# EAGLE design control_board (EAGLE 9.3.2)
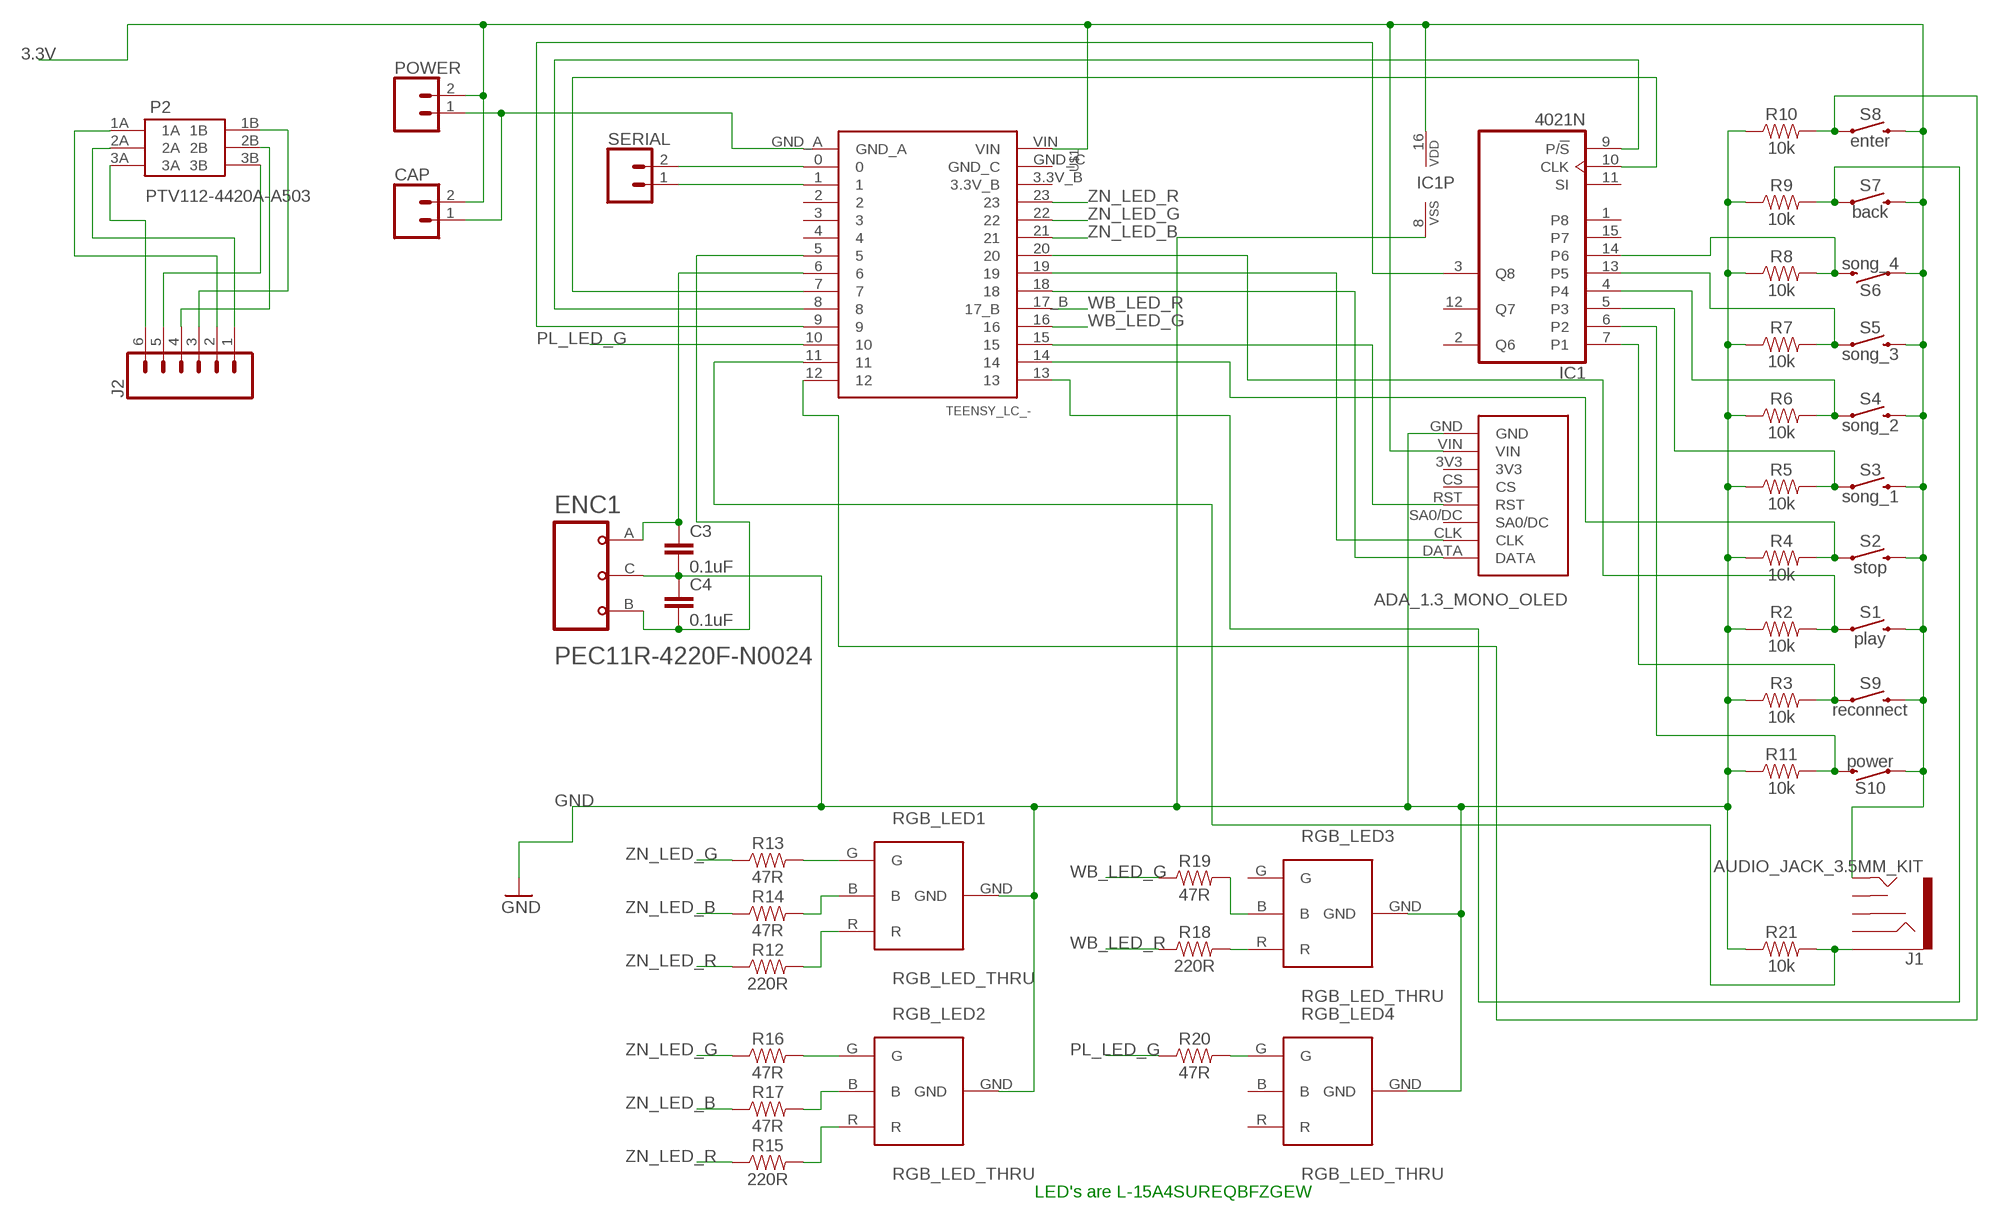
[diagram p0: schematic, sheet 1]

## Parts
C3  0.1uF  0.1UF-KIT-EZ-50V-20%  [CAP-PTH-SMALL-KIT]
C4  0.1uF  0.1UF-KIT-EZ-50V-20%  [CAP-PTH-SMALL-KIT]
CAP  CONN_02  [1X02]
ENC1  PEC11R-4220F-N0024  [PEC11R-4220F-N0024]
IC1  4021N  [DIL16]
J1  AUDIO_JACK_3.5MM_KIT  [AUDIO-JACK-KIT]
J2  CONN_06NO_SILK_NO_POP  [1X06_NO_SILK]
OLED1  ADA_1.3_MONO_OLED  [ADA_1.3_MONO_OLED]
P2  PTV112-4420A-A503  [PTV122-4420A-A503]
POWER  CONN_02  [1X02]
R2  10k  10KOHM-HORIZ-1/4W-1%  [AXIAL-0.3]
R3  10k  10KOHM-HORIZ-1/4W-1%  [AXIAL-0.3]
R4  10k  10KOHM-HORIZ-1/4W-1%  [AXIAL-0.3]
R5  10k  10KOHM-HORIZ-1/4W-1%  [AXIAL-0.3]
R6  10k  10KOHM-HORIZ-1/4W-1%  [AXIAL-0.3]
R7  10k  10KOHM-HORIZ-1/4W-1%  [AXIAL-0.3]
R8  10k  10KOHM-HORIZ-1/4W-1%  [AXIAL-0.3]
R9  10k  10KOHM-HORIZ-1/4W-1%  [AXIAL-0.3]
R10  10k  10KOHM-HORIZ-1/4W-1%  [AXIAL-0.3]
R11  10k  10KOHM-HORIZ-1/4W-1%  [AXIAL-0.3]
R12  220R  100OHM-HORIZ-1/4W-1%  [AXIAL-0.3]
R13  47R  100OHM-HORIZ-1/4W-1%  [AXIAL-0.3]
R14  47R  100OHM-HORIZ-1/4W-1%  [AXIAL-0.3]
R15  220R  100OHM-HORIZ-1/4W-1%  [AXIAL-0.3]
R16  47R  100OHM-HORIZ-1/4W-1%  [AXIAL-0.3]
R17  47R  100OHM-HORIZ-1/4W-1%  [AXIAL-0.3]
R18  220R  100OHM-HORIZ-1/4W-1%  [AXIAL-0.3]
R19  47R  100OHM-HORIZ-1/4W-1%  [AXIAL-0.3]
R20  47R  100OHM-HORIZ-1/4W-1%  [AXIAL-0.3]
R21  10k  10KOHM-HORIZ-1/4W-1%  [AXIAL-0.3]
RGB_LED1  RGB_LED_THRU  [RGB_LEB_RGB_2]
RGB_LED2  RGB_LED_THRU  [RGB_LEB_RGB_2]
RGB_LED3  RGB_LED_THRU  [RGB_LEB_RGB_2]
RGB_LED4  RGB_LED_THRU  [RGB_LEB_RGB_2]
S1  play  MOMENTARY-SWITCH-SPST-PTH-6.0MM  [TACTILE_SWITCH_PTH_6.0MM]
S2  stop  MOMENTARY-SWITCH-SPST-PTH-6.0MM  [TACTILE_SWITCH_PTH_6.0MM]
S3  song_1  MOMENTARY-SWITCH-SPST-PTH-6.0MM  [TACTILE_SWITCH_PTH_6.0MM]
S4  song_2  MOMENTARY-SWITCH-SPST-PTH-6.0MM  [TACTILE_SWITCH_PTH_6.0MM]
S5  song_3  MOMENTARY-SWITCH-SPST-PTH-6.0MM  [TACTILE_SWITCH_PTH_6.0MM]
S6  song_4  MOMENTARY-SWITCH-SPST-PTH-6.0MM  [TACTILE_SWITCH_PTH_6.0MM]
S7  back  MOMENTARY-SWITCH-SPST-PTH-6.0MM  [TACTILE_SWITCH_PTH_6.0MM]
S8  enter  MOMENTARY-SWITCH-SPST-PTH-6.0MM  [TACTILE_SWITCH_PTH_6.0MM]
S9  reconnect  MOMENTARY-SWITCH-SPST-PTH-6.0MM  [TACTILE_SWITCH_PTH_6.0MM]
S10  power  MOMENTARY-SWITCH-SPST-PTH-6.0MM  [TACTILE_SWITCH_PTH_6.0MM]
SERIAL  CONN_02  [1X02]
U$1  TEENSY_LC_-  [TEENSY_LC_-]

## Nets
3.3V: CAP.2 IC1.16(VDD) J1.TIP OLED1.VIN POWER.2 S1.3 S2.3 S3.3 S4.3 S5.3 S6.1 S7.3 S8.3 S9.3 S10.1 U$1.VIN
GND: C3.2 C4.1 CAP.1 ENC1.C(COMMON) IC1.8(VSS) OLED1.GND POWER.1 R2.P$1 R3.P$1 R4.P$1 R5.P$1 R6.P$1 R7.P$1 R8.P$1 R9.P$1 R10.P$1 R11.P$1 R21.P$1 RGB_LED1.GND RGB_LED2.GND RGB_LED3.GND RGB_LED4.GND U$1.GND_A
N$1: IC1.3(Q8) U$1.9
N$2: R13.P$2 RGB_LED1.G
N$3: R14.P$2 RGB_LED1.B
N$4: IC1.10(CLK) U$1.7
N$5: R12.P$2 RGB_LED1.R
N$6: R16.P$2 RGB_LED2.G
N$7: R17.P$2 RGB_LED2.B
N$8: IC1.9(P/!S) U$1.8
N$9: OLED1.DATA U$1.18
N$10: R4.P$2 S2.1 U$1.14
N$11: R9.P$2 S7.1 U$1.13
N$12: IC1.5(P3) R5.P$2 S3.1
N$13: IC1.4 R6.P$2 S4.1
N$14: J1.SLEEVE R21.P$2 U$1.11
N$15: IC1.13(P5) R7.P$2 S5.1
N$16: IC1.14(P6) R8.P$2 S6.3
N$17: SERIAL.1 U$1.1
N$18: R10.P$2 S8.1 U$1.12
N$19: C3.1 ENC1.A(CHANNEL_A) U$1.6
N$20: C4.2 ENC1.B(COMMON_B) U$1.5
N$21: IC1.7(P1) R3.P$2 S9.1
N$22: IC1.6(P2) R11.P$2 S10.3
N$23: R15.P$2 RGB_LED2.R
N$24: R19.P$2 RGB_LED3.B
N$25: R18.P$2 RGB_LED3.R
N$26: R20.P$2 RGB_LED4.G
N$27: R2.P$2 S1.1 U$1.20
N$28: SERIAL.2 U$1.0
N$29: J2.2 P2.1A
N$30: OLED1.CLK U$1.19
N$31: OLED1.RST U$1.15
N$32: J2.1 P2.2A
N$33: J2.6 P2.3A
N$34: J2.4 P2.2B
N$35: J2.5 P2.3B
N$38: J2.3 P2.1B
PL_LED_G: R20.P$1 U$1.10
WB_LED_G: R19.P$1 U$1.16
WB_LED_R: R18.P$1 U$1.17_B
ZN_LED_B: R14.P$1 R17.P$1 U$1.21
ZN_LED_G: R13.P$1 R16.P$1 U$1.22
ZN_LED_R: R12.P$1 R15.P$1 U$1.23
Unconnected: IC1.1(P8) IC1.2(Q6) IC1.11(SI) IC1.12(Q7) IC1.15(P7) J1.RING J1.RSH J1.TSH OLED1.3V3 OLED1.CS OLED1.SA0/DC RGB_LED3.G RGB_LED4.B RGB_LED4.R U$1.2 U$1.3 U$1.3.3V_B U$1.4 U$1.GND_C

## Notes on the sheet
- LED's are L-15A4SUREQBFZGEW

## Library data of the parts
C3 C4 = SparkFun-Capacitors:0.1UF: 0.1µF ceramic capacitors A capacitor is a passive two-terminal electrical component used to store electrical energy temporarily in an electric field.; PROD_ID: CAP-08370
CAP POWER SERIAL = SparkFun-Connectors:CONN_02: Multi connection point. Often used as Generic Header-pin footprint for 0.1 inch spaced/style header connections On any of the 0.1 inch spaced packages, you can populate with these: Break Away Headers - Straight <https://www.sparkfun.com/products/116> (PRT-00116) Break Away Male Headers - Right Angle <https://www.sparkfun.com/products/553> (PRT-00553) Female Headers <https://www.sparkfun.com/products/115> (PRT-00115) Break Away Headers - Machine Pin <https://www.sparkfun.com/products/117> (PRT-00117) Break Away Female Headers - Swiss Machine Pin <https://www.sparkfun.com/products/743> (PRT-00743) For SCREWTERMINALS and SPRING TERMINALS visit here: Screw Terimnals on SparkFun.com <https://www.sparkfun.com/search/results?term=Screw+Terminals> (5mm/3.5mm/2.54mm spacing) This device is also useful as a general connection point to wire up your design to another part of your project. Our various solder wires solder well into these plated through hole pads. Hook-Up Wire - Assortment (Stranded, 22 AWG) <https://www.sparkfun.com/products/11375> (PRT-11375) Hook-Up Wire - Assortment (Solid Core, 22 AWG) <https://www.sparkfun.com/products/11367> (PRT-11367) View the entire wire category on our website here <https://www.sparkfun.com/categories/141> Special notes: Molex polarized connector foot print use with: PRT-08233 with associated crimp pins and housings. 2.54_SCREWTERM for use with PRT-10571. 3.5mm Screw Terminal footprints for PRT-08084 5mm Screw Terminal footprints for use with PRT-08432
ENC1 = my_library:PEC11R-4220F-N0024
IC1 = 40xx:4021: 8-bit static SHIFT REGISTER
J1 = SparkFun-Connectors:AUDIO_JACK_3.5MM: Audio Jack 3.5mm variants of PTH and SMT stereo audio jack with bypass switches. SparkFun Products: SparkFun SparkPunk Sound Kit <[https://www.sparkfun.com/products/11177]> - PTH MP3 Trigger <https://www.sparkfun.com/products/13720> -3.5mm SMD SparkFun PicoBoard <https://www.sparkfun.com/products/11888>- 2.5mm SMD; PROD_ID: CONN-08774; SF_ID: PRT-08032
J2 = SparkFun-Connectors:CONN_06: Multi connection point. Often used as Generic Header-pin footprint for 0.1 inch spaced/style header connections On any of the 0.1 inch spaced packages, you can populate with these: Break Away Headers - Straight <https://www.sparkfun.com/products/116> (PRT-00116) Break Away Male Headers - Right Angle <https://www.sparkfun.com/products/553> (PRT-00553) Female Headers <https://www.sparkfun.com/products/115> (PRT-00115) Break Away Headers - Machine Pin <https://www.sparkfun.com/products/117> (PRT-00117) Break Away Female Headers - Swiss Machine Pin <https://www.sparkfun.com/products/743> (PRT-00743) Arduino Stackable Header - 6 Pin <https://www.sparkfun.com/products/9280> (PRT-09280) For SCREWTERMINALS and SPRING TERMINALS visit here: Screw Terimnals on SparkFun.com <https://www.sparkfun.com/search/results?term=Screw+Terminals> (5mm/3.5mm/2.54mm spacing) This device is also useful as a general connection point to wire up your design to another part of your project. Our various solder wires solder well into these plated through hole pads. Hook-Up Wire - Assortment (Stranded, 22 AWG) <https://www.sparkfun.com/products/11375> (PRT-11375) Hook-Up Wire - Assortment (Solid Core, 22 AWG) <https://www.sparkfun.com/products/11367> (PRT-11367) View the entire wire category on our website here <https://www.sparkfun.com/categories/141>
OLED1 = my_library:ADA_1.3_MONO_OLED
P2 = my_library:PTV112-4420A-A503
R2-R11 R21 = SparkFun-Resistors:10KOHM: 10kΩ resistor A resistor is a passive two-terminal electrical component that implements electrical resistance as a circuit element. Resistors act to reduce current flow, and, at the same time, act to lower voltage levels within circuits. - Wikipedia; PROD_ID: RES-12183
R12-R20 = SparkFun-Resistors:100OHM: 100Ω resistor A resistor is a passive two-terminal electrical component that implements electrical resistance as a circuit element. Resistors act to reduce current flow, and, at the same time, act to lower voltage levels within circuits. - Wikipedia; PROD_ID: RES-12181; VALUE: 100
RGB_LED1-RGB_LED4 = my_library:RGB_LED_THRU
S1-S10 = SparkFun-Switches:MOMENTARY-SWITCH-SPST: Momentary Switch (Pushbutton) - SPST Normally-open (NO) SPST momentary switches (buttons, pushbuttons). Variants PTH-12MM - 12mm square, through-hole Momentary Pushbutton Switch - 12mm Square <https://www.sparkfun.com/products/9190> (COM-09190) PTH-6.0MM, PTH-6.0MM-KIT - 6.0mm square, through-hole Mini Pushbutton Switch <https://www.sparkfun.com/products/97> (COM-00097) KIT package intended for soldering kit's - only one side of pads' copper is exposed. PTH-RIGHT-ANGLE-KIT - Right-angle, through-hole Right Angle Tactile Button <https://www.sparkfun.com/products/10791> - Used on SparkFun BigTime Watch Kit <https://www.sparkfun.com/products/11734> SMD-12MM - 12mm square, surface-mount Tactile Button - SMD (12mm) <https://www.sparkfun.com/products/12993> (COM-12993) Used on SparkFun PicoBoard <https://www.sparkfun.com/products/11888> SMD-4.5MM - 4.5mm Square Trackball Switch Used on SparkFun Blackberry Trackballer Breakout <https://www.sparkfun.com/products/13169> SMD-4.6MMX2.8MM - 4.60mm x 2.80mm, surface mount Used on SparkFun SAMD21 Mini Breakout <https://www.sparkfun.com/products/13664> SMD-5.2MM, SMD-5.2-REDUNDANT - 5.2mm square, surface-mount Mini Pushbutton Switch - SMD <https://www.sparkfun.com/products/8720> (COM-08720) Used on Arduino Pro Mini <https://www.sparkfun.com/products/11114> REDUNDANT package connects both switch circuits together SMD-6.0X3.5MM - 6.0 x 3.5mm, surface mount Momentary Reset Switch SMD <https://www.sparkfun.com/products/8229> (COM-08229) SMD-6.2MM-TALL - 6.2mm square, surface mount Tactile Button - SMD (6mm) <https://www.sparkfun.com/products/12992> Used on SparkFun Digital Sandbox <https://www.sparkfun.com/products/12651> SMD-RIGHT-ANGLE - Right-angle, surface mount Used on SparkFun Block for Intel® Edison - Arduino <https://www.sparkfun.com/products/13036>; PROD_ID: SWCH-08441; SF_SKU: COM-00097
U$1 = my_library:TEENSY_LC_-

## Board
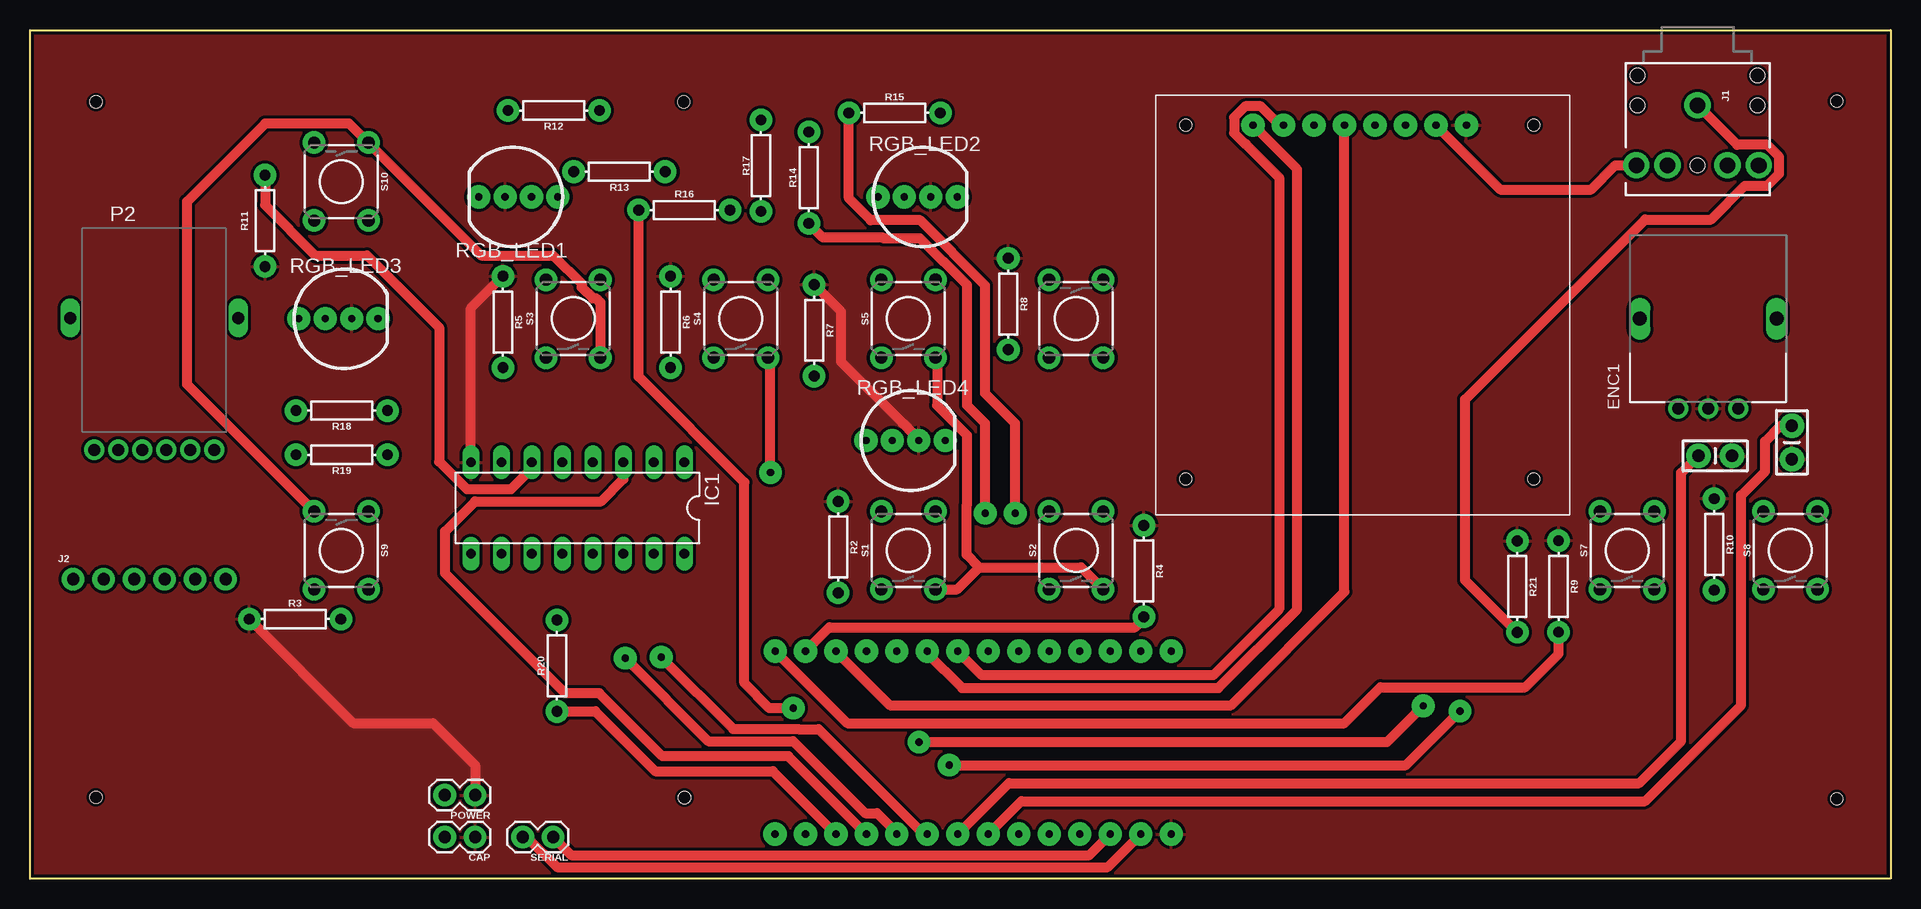
[diagram p1: board, top side]
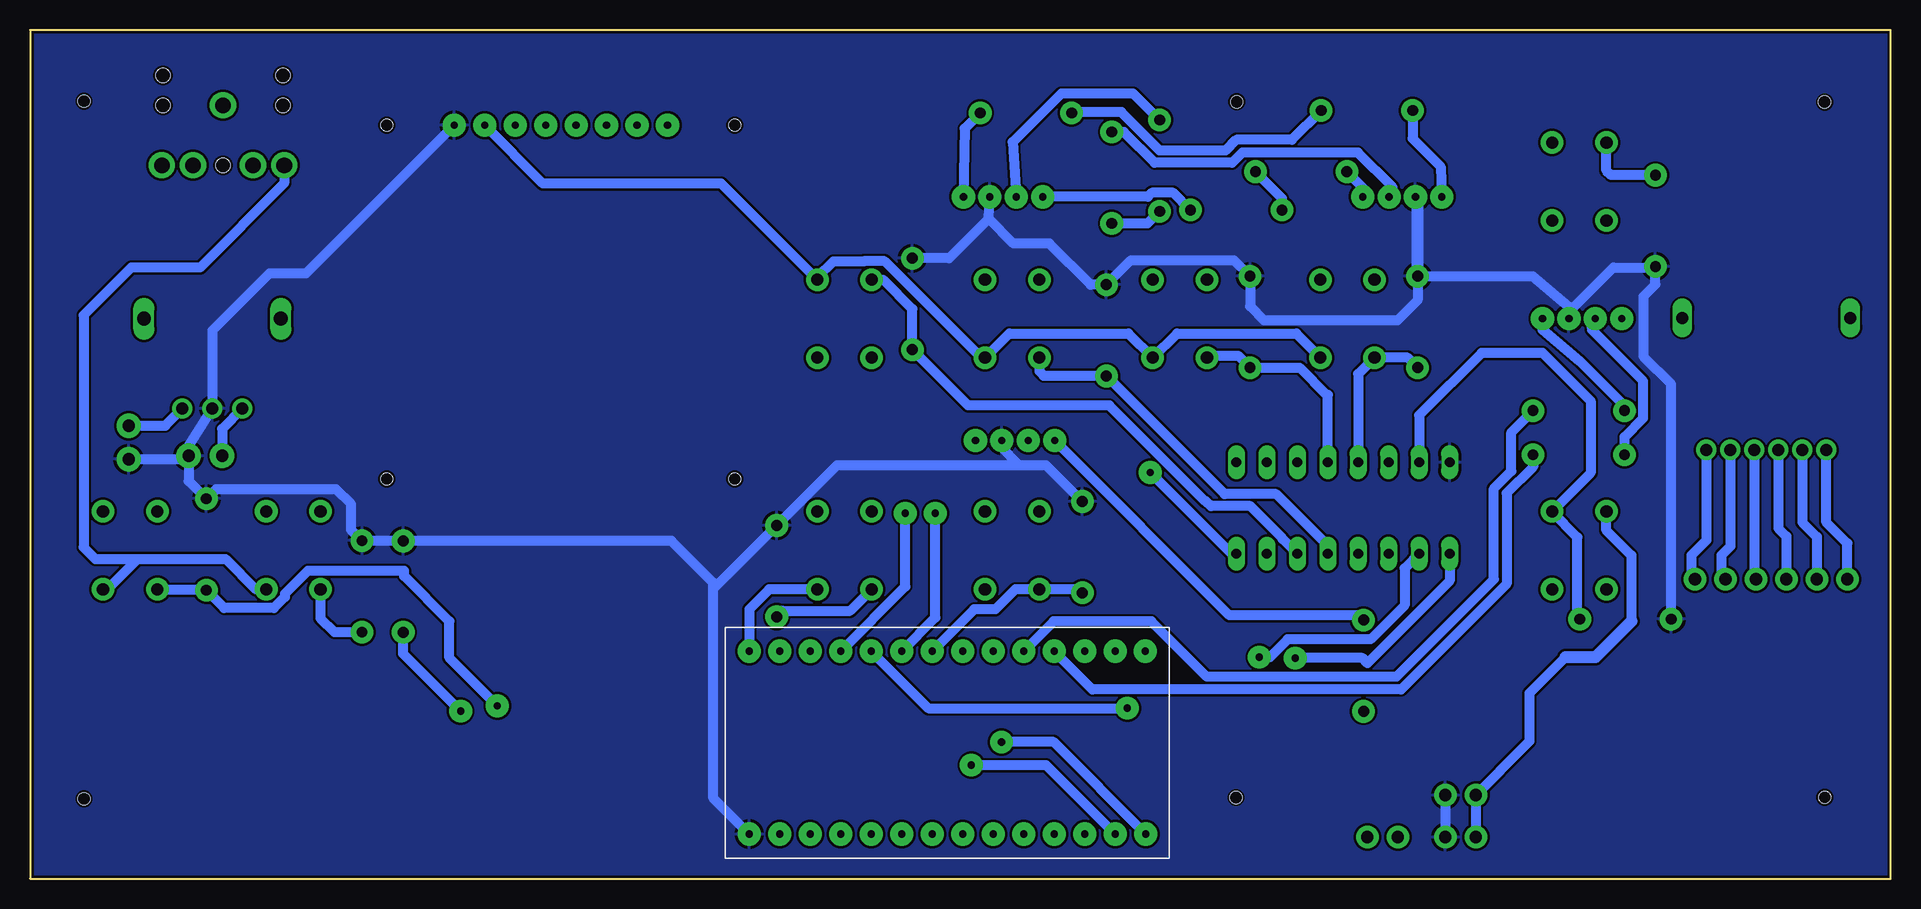
[diagram p2: board, bottom side, seen from below]

Size 155.05 x 70.77 mm. Coordinates in mm from the lower left corner, seen from the top.
Outline: 0,0 0,70.76 155.05,70.77 155.05,0 0,0
Copper layers (1*16): Top 0.035mm / dielectric 1.5mm / Bottom 0.035mm
Design rules "SparkFun": minimum track width 8mil, minimum drill 20mil, track to track 8mil, track to pad 8mil, pad to pad 8mil, via to via 8mil, smd to smd 8mil, copper to edge 8mil, drill to drill 8mil, minimum pad ring 12mil, minimum via ring 10mil, stop-mask expansion 4mil, vias tented up to drill 20mil, thermal gap 10mil
Holes 1 mm at 5.5,64.77 5.5,6.79 150.55,6.67 150.55,64.83 54.49,64.78 54.54,6.78

### Footprints (pad centres in the part's own frame; a part is rotated, then mirrored left to right if it is on the bottom)
CAP-PTH-SMALL-KIT = drill 1.016 pad 2.032: 1 -1.397,0; 2 1.397,0
1X02 = drill 1.016 pad 1.88: 1 0,0; 2 2.54,0
PEC11R-4220F-N0024 = drill 1.15 pad 1.75 long: 3 -5.7,0; 4 5.7,0 | drill 1 pad 1.676: A -2.5,-7.5; B 2.5,-7.5; C 0,-7.5
DIL16 = drill 0.813 long: 1 -8.89,-3.81; 2 -6.35,-3.81; 3 -3.81,-3.81; 4 -1.27,-3.81; 5 1.27,-3.81; 6 3.81,-3.81; 7 6.35,-3.81; 8 8.89,-3.81; 9 8.89,3.81; 10 6.35,3.81; 11 3.81,3.81; 12 1.27,3.81; 13 -1.27,3.81; 14 -3.81,3.81; 15 -6.35,3.81; 16 -8.89,3.81
AUDIO-JACK-KIT = drill 1.3 pad 2.184: RING 5,5.1; RSH 5,2.5; SLEEVE 0,0; TIP 5,-5.1; TSH 5,-2.5 | hole 1.2: 0,5; -2.5,5; -2.5,-5; 0,-5; 5,0
1X06_NO_SILK = drill 1.016 pad 1.88: 1 0,0; 2 2.54,0; 3 5.08,0; 4 7.62,0; 5 10.16,0; 6 12.7,0
ADA_1.3_MONO_OLED = drill 0.6 pad 1.93: 3V3 3.8,0; CLK -6.36,0; CS 1.26,0; DATA -8.9,0; GND 8.88,0; RST -1.28,0; SA0/DC -3.82,0; VIN 6.34,0 | hole 1: -14.5,0; 14.5,0; -14.5,-29.5; 14.5,-29.5
PTV122-4420A-A503 = drill 1 pad 1.676: 1A 2,0; 1B 4,0; 2A 0,0; 2B 6,0; 3A 10,0; 3B 8,0 | drill 1 long: L1 -2,11; L2 12,11
AXIAL-0.3 = drill 0.9 pad 1.88: P$1 -3.81,0; P$2 3.81,0
RGB_LEB_RGB_2 = drill 0.6 pad 1.93: B 2.2,0; G 0,0; GND 4.4,0; R 6.6,0
TACTILE_SWITCH_PTH_6.0MM = drill 1.016 pad 1.88: 1 -3.251,2.261; 2 3.251,2.261; 3 -3.251,-2.261; 4 3.251,-2.261
TEENSY_LC_- = drill 0.6 pad 1.93: 0 4.54,-17.25; 1 7.08,-17.25; 2 9.62,-17.25; 3 12.16,-17.25; 3.3V_B 7.08,-2; 4 14.7,-17.25; 5 17.24,-17.25; 6 19.78,-17.25; 7 22.32,-17.25; 8 24.86,-17.25; 9 27.4,-17.25; 10 29.94,-17.25; 11 32.48,-17.25; 12 35.02,-17.25; 13 35,-2; 14 32.48,-2; 15 29.94,-2; 16 27.4,-2; 17_B 24.86,-2; 18 22.32,-2; 19 19.78,-2; 20 17.24,-2; 21 14.7,-2; 22 12.16,-2; 23 9.62,-2; GND_A 2,-17.25; GND_C 4.54,-2; VIN 2,-2

### Placement (x,y rotation side)
C3  140.43,35.27 0 top
C4  146.82,36.38 90 top
CAP  37.1,3.48 180 top
ENC1  139.85,46.7 0 top
IC1  45.63,30.92 180 top
J1  138.96,64.49 270 top
J2  3.6,24.98 0 top
OLED1  110.82,62.84 0 top
P2  5.35,35.77 0 top
POWER  37.1,6.98 180 top
R2  67.35,27.65 270 top
R3  22.09,21.65 0 top
R4  92.82,25.65 270 top
R5  39.41,46.43 270 top
R6  53.38,46.43 270 top
R7  65.35,45.73 270 top
R8  81.52,47.93 270 top
R9  127.38,24.38 270 top
R10  140.35,27.88 270 top
R11  19.59,54.86 90 top
R12  43.64,64.06 180 top
R13  49.12,58.96 180 top
R14  64.9,58.46 90 top
R15  72.05,63.86 0 top
R16  54.53,55.76 0 top
R17  60.91,59.46 90 top
R18  25.98,39.04 180 top
R19  25.98,35.35 180 top
R20  43.91,17.77 90 top
R21  123.95,24.36 270 top
RGB_LED1  43.99,56.86 180 top
RGB_LED2  70.66,56.86 0 top
RGB_LED3  22.4,46.7 0 top
RGB_LED4  69.66,36.54 0 top
S1  73.2,27.39 90 top
S2  87.17,27.39 90 top
S3  45.26,46.7 90 top
S4  59.23,46.7 90 top
S5  73.2,46.7 90 top
S6  87.17,46.7 270 top
S7  133.1,27.39 90 top
S8  146.7,27.39 90 top
S9  25.94,27.39 270 top
S10  25.94,58.13 270 top
SERIAL  43.6,3.48 180 top
U$1  97.1,20.98 0 bottom

### Tracks (layer width: path | path; a pad name or v marks a point on that pad's centre or on a via)
3.3V  (via drill 0.6 pad 1.9)
  Top 0.813: S3.3 47.52,48.06 47.18,48.4 46.88,48.4 45.97,49.31 45.97,49.61 43.6,51.98 37.6,51.98 S10.1 26.6,62.98 19.6,62.98 13.1,56.48 13.1,41.22 S9.3 | OLED1.VIN 122.52,57.48 130.1,57.48 132.11,59.49 J1.TIP | S1.3 77.26,24.14 79.1,25.98 | S2.3 87.59,25.98 79.1,25.98 | 79.1,25.98 78.04,27.04 78.04,31.13 78.1,31.19 78.1,36.98 75.6,39.48 75.6,43.31 S5.3 | v61.7,33.88 61.7,43.24 S4.3
  Bottom 0.813: S3.3 49.52,45.45 49.52,45.48 59.46,45.48 S4.3 63.52,45.48 73.43,45.48 S5.3 75.78,43.45 83.83,51.5 85.55,51.5 85.57,51.48 88.1,51.48 89.43,50.15 S6.1 97.46,57.98 112.3,57.98 OLED1.VIN | S8.3 148.6,24.14 146.08,26.65 | 146.08,26.65 149.6,26.65 150.59,27.63 150.59,47 146.6,50.98 140.87,50.98 133.86,57.99 J1.TIP | 146.08,26.65 138.74,26.65 136.22,24.14 S7.3 | 21.6,21.48 21.6,26.98 23.68,29.06 S9.3 | 27.1,18.48 30.1,15.48 30.1,11.48 32.56,9.02 32.56,8.98 POWER.2 CAP.2 | S2.3 93.45,24.14 95.1,22.48 U$1.VIN | IC1.16 54.94,27.11 v61.7,33.88
  Bottom 1.016: 21.6,21.48 24.6,18.48 27.1,18.48
GND
  Top 0.813: IC1.8 36.74,47.57 R5.P$1 | R7.P$1 67.6,47.29 67.6,43.1 72.71,37.99 72.76,37.99 73.61,37.14 73.61,37.09 RGB_LED4.GND | R3.P$1 26.95,12.98 33.6,12.98 37.1,9.48 POWER.1
  Bottom 0.813: 141.85,35.3 142.16,35.6 ENC1.C 139.85,45.73 135.1,50.48 132.06,50.48 OLED1.GND | 141.85,35.3 C3.2 141.83,33.17 R10.P$1 139.56,32.48 129.53,32.48 128.29,31.25 128.29,29.1 R9.P$1 127.36,28.17 R21.P$1 101.59,28.17 98.1,24.68 98.1,24.18 | R2.P$1 70.37,34.48 72.6,34.48 | C4.1 142.16,34.99 141.85,35.3 | R3.P$1 18.28,41.24 20.59,43.55 20.59,48.55 19.59,49.55 R11.P$1 19.66,50.98 23.1,50.98 26.9,47.18 RGB_LED3.GND 26.8,47.7 29.8,50.24 R5.P$1 39.41,48.24 41.07,46.58 52.22,46.58 53.38,47.74 R6.P$1 54.72,51.58 63.31,51.58 R7.P$1 66.66,49.54 70.1,52.98 73.1,52.98 75.16,55.04 | POWER.1 CAP.1 | 75.16,55.04 RGB_LED2.GND | 75.16,55.04 78.46,51.74 R8.P$1 | U$1.GND_A 98.1,6.73 98.1,24.18 | 98.1,24.18 R4.P$1 87.8,34.48 72.6,34.48 | 72.6,34.48 74.16,36.04 RGB_LED4.GND
  Bottom 1.016: R5.P$1 39.41,56.78 RGB_LED1.GND
  pour Bottom: 0.1,70.48 0.1,-0.02 154.6,-0.02 154.6,70.48
  pour Top (isolate 0.254): 0.1,70.48 0.1,-0.02 154.6,-0.02 154.6,70.48
N$1
  Top 0.813: U$1.9 63.2,10.23 52.7,10.23 47.45,15.48 44.6,15.48 34.6,25.48 34.6,28.98 37.1,31.48 47.6,31.48 49.44,33.32 IC1.3
N$2
  Bottom 0.813: RGB_LED1.G 43.49,57.14 R13.P$2
N$3
  Bottom 0.813: RGB_LED1.B 41.49,57.65 44.4,60.56 54.02,60.56 54.87,59.71 61.34,59.71 63.9,62.27 R14.P$2
N$4  (via drill 0.6 pad 1.9)
  Top 0.813: v52.6,18.48 58.59,12.5 64.02,12.5 64.04,12.48 65.72,12.48 74.47,3.73 U$1.7
  Bottom 0.813: IC1.10 40.5,25.89 40.5,22.8 43.34,19.97 50.25,19.97 51.73,18.48 v52.6,18.48
N$5
  Bottom 0.813: R12.P$2 39.83,61.71 37.49,59.37 RGB_LED1.R
N$6
  Bottom 0.813: RGB_LED2.G 61.89,56.86 61.55,57.2 59.78,57.2 R16.P$2
N$7
  Bottom 0.813: R17.P$2 63.12,65.48 69.1,65.48 73.16,61.42 RGB_LED2.B
N$8  (via drill 0.6 pad 1.9)
  Top 0.813: v49.6,18.41 56.52,11.48 63.6,11.48 69.6,5.48 70.6,5.48 72.24,3.84 U$1.8
  Bottom 0.813: IC1.9 36.74,24.84 43.6,17.98 44.02,18.41 v49.6,18.41
N$9
  Top 0.813: U$1.18 74.78,18.8 77.67,15.91 99.03,15.91 105.6,22.48 105.6,59.16 OLED1.DATA
N$10
  Top 0.813: U$1.14 66.62,20.98 92.1,20.98 92.82,21.7 R4.P$2
  Bottom 0.813: R4.P$2 92.32,22.34 86.7,22.34 S2.1
N$11
  Top 0.813: U$1.13 68.12,12.97 109.52,12.97 112.54,15.98 124.6,15.98 127.38,18.76 R9.P$2
  Bottom 0.813: S7.1 130.84,21.72 129.69,20.57 R9.P$2
N$12
  Bottom 0.813: R5.P$2 40.24,43.45 S3.1 44.36,42.09 IC1.5
N$13
  Bottom 0.813: IC1.4 46.9,40.35 46.97,40.35 49.25,42.62 R6.P$2 54.38,43.62 56.8,43.62 S4.1
N$14  (via drill 0.6 pad 1.9)
  Top 0.813: R21.P$2 119.6,24.9 119.6,39.98 134.6,54.98 140.1,54.98 142.91,57.79 144.77,57.79 145.76,58.79 145.76,60.2 144.77,61.19 142.26,61.19 J1.SLEEVE | v76.6,9.48 114.66,9.48 v119.16,13.98
  Bottom 0.813: U$1.11 70.37,9.48 v76.6,9.48 | v119.16,13.98 123.95,18.77 R21.P$2
N$15
  Bottom 0.813: IC1.13 46.9,27.78 51.2,32.08 55.49,32.08 64.75,41.35 64.78,41.35 R7.P$2 65.38,41.96 70.57,41.96 70.94,42.32 S5.1
N$16
  Bottom 0.813: S6.3 83.95,49.95 81.52,47.52 R8.P$2 76.88,39.48 65.1,39.48 57.1,31.48 57.04,31.48 56.62,31.07 53.36,31.07 50.66,28.37 50.66,28.33 IC1.14
N$17
  Top 0.813: SERIAL.1 45.1,1.98 88.27,1.98 U$1.1
N$18  (via drill 0.6 pad 1.9)
  Top 0.813: v74.09,11.41 113.09,11.41 v116.1,14.42
  Bottom 0.813: S8.1 144.38,24.07 R10.P$2 138.87,22.59 134.72,22.59 133.81,23.49 133.81,23.77 131.9,25.69 123.87,25.69 123.87,25.25 120.1,21.48 120.1,18.42 v116.1,14.42 | U$1.12 69.76,11.41 v74.09,11.41
N$19
  Top 0.813: U$1.6 81.57,7.98 134.1,7.98 137.6,11.48 137.6,33.84 C3.1
  Bottom 0.813: ENC1.A 139.03,37.52 C3.1
N$20
  Top 0.813: U$1.5 82.61,6.48 134.6,6.48 142.6,14.48 142.6,31.98 144.6,33.98 144.6,36.48 145.9,37.78 C4.2
  Bottom 0.813: C4.2 143.77,37.78 ENC1.B
N$21
  Bottom 0.813: IC1.7 39.28,38.65 34.09,43.85 28.99,43.85 25,39.86 25,33.84 S9.1 28.2,30.58 26.1,28.48 26.1,21.85 R3.P$2
N$22
  Top 0.813: R11.P$2 19.59,56.17 23.78,51.98 28.1,51.98 34.1,45.98 34.1,34.79 36.4,32.5 40.1,32.5 41.82,34.22 IC1.6
  Bottom 0.813: R11.P$2 23.29,58.67 23.68,59.06 S10.3
N$23
  Bottom 0.813: R15.P$2 77.16,62.56 RGB_LED2.R
N$24
  Bottom 0.813: R19.P$2 22.17,36.85 20.62,38.4 20.62,41.5 24.9,45.78 RGB_LED3.B
N$25
  Bottom 0.813: RGB_LED3.R 29,45.78 25.9,43.15 22.17,39.43 R18.P$2
N$26
  Bottom 0.813: R20.P$2 44.31,21.98 55.1,21.98 RGB_LED4.G
N$27
  Bottom 0.813: R2.P$2 67.65,24.14 S1.1 72.94,24.14 74.59,22.48 76.36,22.48 U$1.20
N$28
  Top 0.813: SERIAL.2 41.41,3.48 43.93,0.97 89.8,0.97 U$1.0
N$29
  Bottom 0.813: P2.1A 7.35,29.73 6.14,28.52 J2.2
N$30
  Top 0.813: OLED1.CLK 104.15,62.84 102.57,64.42 101.27,64.42 100.35,63.49 100.35,62.19 101.27,61.27 101.32,61.27 104.1,58.48 104.1,22.48 98.6,16.98 79.32,16.98 U$1.19
N$31
  Top 0.813: U$1.15 71.66,14.48 100.1,14.48 109.54,23.92 OLED1.RST
N$32
  Bottom 0.813: P2.2A 5.35,29.73 3.6,27.98 J2.1
N$33
  Bottom 0.813: P2.3A 15.35,28.23 16.6,26.98 16.6,25.28 J2.6
N$34
  Bottom 0.813: P2.2B 11.35,25.11 J2.4
N$35
  Bottom 0.813: P2.3B 13.35,27.73 14.1,26.98 14.1,25.32 J2.5
N$38
  Bottom 0.813: P2.1B 9.35,29.23 8.68,28.56 J2.3
PL_LED_G
  Top 0.813: R20.P$1 47.12,13.96 52.1,8.98 61.91,8.98 U$1.10
WB_LED_G
  Bottom 0.813: R19.P$1 29.79,34.35 31.99,32.15 31.99,24.59 40.79,15.79 66.51,15.79 U$1.16
WB_LED_R
  Bottom 0.813: R18.P$1 31.6,37.23 31.6,33.98 33.05,32.53 33.05,24.97 41.18,16.85 56.97,16.85 61.6,21.48 69.74,21.48 U$1.17_B
ZN_LED_B  (via drill 0.6 pad 1.9)
  Top 0.813: v79.6,30.48 79.6,37.98 78.1,39.48 78.1,49.51 76.1,51.5 76.08,51.5 74.19,53.4 71.14,53.4 71.06,53.48 66.07,53.48 R14.P$1
  Bottom 0.813: R14.P$1 61.91,54.65 R17.P$1 | U$1.21 79.6,21.78 v79.6,30.48
ZN_LED_G  (via drill 0.6 pad 1.9)
  Top 0.813: R16.P$1 50.72,41.86 59.53,33.06 59.53,16.33 61.62,14.23 v63.6,14.23
  Bottom 0.813: R13.P$1 50.72,56.75 R16.P$1 | U$1.22 80.19,14.23 v63.6,14.23
ZN_LED_R  (via drill 0.6 pad 1.9)
  Top 0.813: R15.P$1 68.24,56.73 70.06,54.91 74.17,54.91 79.6,49.48 79.6,40.48 82.1,37.98 v82.1,30.48
  Bottom 0.813: R12.P$1 49.89,61.62 54.51,61.62 55.41,60.72 60.91,60.72 64.11,63.92 68.18,63.92 R15.P$1 | U$1.23 82.1,24.36 v82.1,30.48